# EAGLE design TLC5951_TestBrd (EAGLE 6.1)
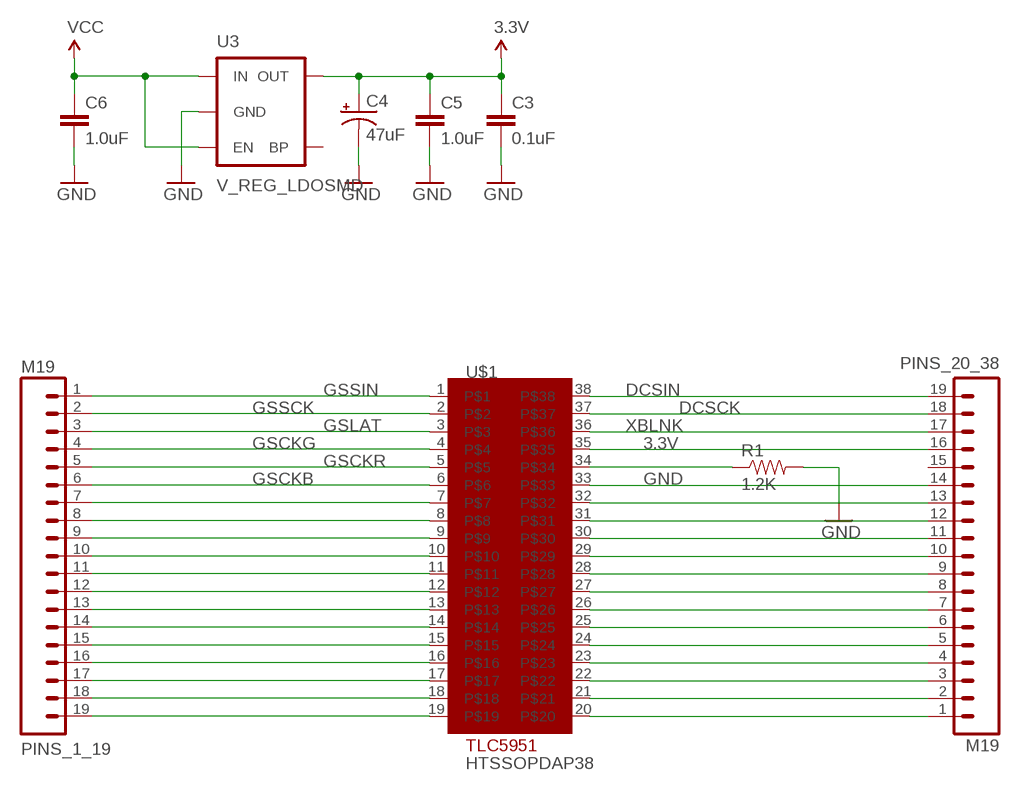
[diagram p0: schematic, sheet 1]

## Parts
C3  0.1uF  CAP0402-CAP  [0402-CAP]
C4  47uF  CAP_POL3528  [EIA3528]
C5  1.0uF  CAP0402-CAP  [0402-CAP]
C6  1.0uF  CAP0402-CAP  [0402-CAP]
PINS_1_19  M19  [1X19]
PINS_20_38  M19  [1X19]
R1  1.2K  RESISTORPTH-1W  [AXIAL-0.6]
U3  V_REG_LDOSMD  [SOT23-5]
U$1  HTSSOPDAP38  [HTSSOPDAP38]

## Nets
3.3V: C3.1 C4.A(+) C5.1 PINS_20_38.16 U3.5(OUT) U$1.35
DCSCK: PINS_20_38.18 U$1.37
DCSIN: PINS_20_38.19 U$1.38
GND: C3.2 C4.C(-) C5.2 C6.2 PINS_20_38.14 R1.P$2 U3.2(GND) U$1.33
GSCKB: PINS_1_19.6 U$1.6
GSCKG: PINS_1_19.4 U$1.4
GSCKR: PINS_1_19.5 U$1.5
GSLAT: PINS_1_19.3 U$1.3
GSSCK: PINS_1_19.2 U$1.2
GSSIN: PINS_1_19.1 U$1.1
N$1: PINS_20_38.13 U$1.32
N$2: R1.P$1 U$1.34
N$3: PINS_20_38.12 U$1.31
N$4: PINS_20_38.11 U$1.30
N$5: PINS_20_38.10 U$1.29
N$6: PINS_20_38.9 U$1.28
N$7: PINS_20_38.8 U$1.27
N$8: PINS_20_38.7 U$1.26
N$9: PINS_20_38.6 U$1.25
N$10: PINS_20_38.5 U$1.24
N$11: PINS_20_38.4 U$1.23
N$12: PINS_20_38.3 U$1.22
N$13: PINS_20_38.2 U$1.21
N$14: PINS_20_38.1 U$1.20
N$15: PINS_1_19.7 U$1.7
N$16: PINS_1_19.8 U$1.8
N$17: PINS_1_19.9 U$1.9
N$18: PINS_1_19.10 U$1.10
N$19: PINS_1_19.11 U$1.11
N$20: PINS_1_19.12 U$1.12
N$21: PINS_1_19.13 U$1.13
N$22: PINS_1_19.14 U$1.14
N$23: PINS_1_19.15 U$1.15
N$24: PINS_1_19.16 U$1.16
N$25: PINS_1_19.17 U$1.17
N$26: PINS_1_19.18 U$1.18
N$27: PINS_1_19.19 U$1.19
VCC [VCC]: C6.1 U3.1(IN) U3.3(EN)
XBLNK: PINS_20_38.17 U$1.36
Unconnected: PINS_20_38.15 U3.4(BP)

## Library data of the parts
C3 C5 C6 = SparkFun:CAP: Capacitor Standard 0603 ceramic capacitor, and 0.1" leaded capacitor.
C4 = SparkFun:CAP_POL: Capacitor Polarized These are standard SMD and PTH capacitors. Normally 10uF, 47uF, and 100uF in electrolytic and tantalum varieties. Always verify the external diameter of the through hole cap, it varies with capacity, voltage, and manufacturer. The EIA devices should be standard.
PINS_1_19 PINS_20_38 = SparkFun-Connectors:M19: 1x19 .1" header
R1 = SparkFun-Passives:RESISTOR: Resistor Basic schematic elements and footprints for 0603, 1206, and PTH resistors.
U3 = SparkFun:V_REG_LDO: Voltage Regulator LDO Standard 150mA LDO voltage regulator in SOT-23 layout. Micrel part MIC5205. BP (by-pass) pin is used to lower output noise with 470pF cap.
U$1 = TLC5951_DAP38:HTSSOPDAP38

## Net classes
0 Default: width 0.203 mm
1 VCC: width 0.305 mm

## Board
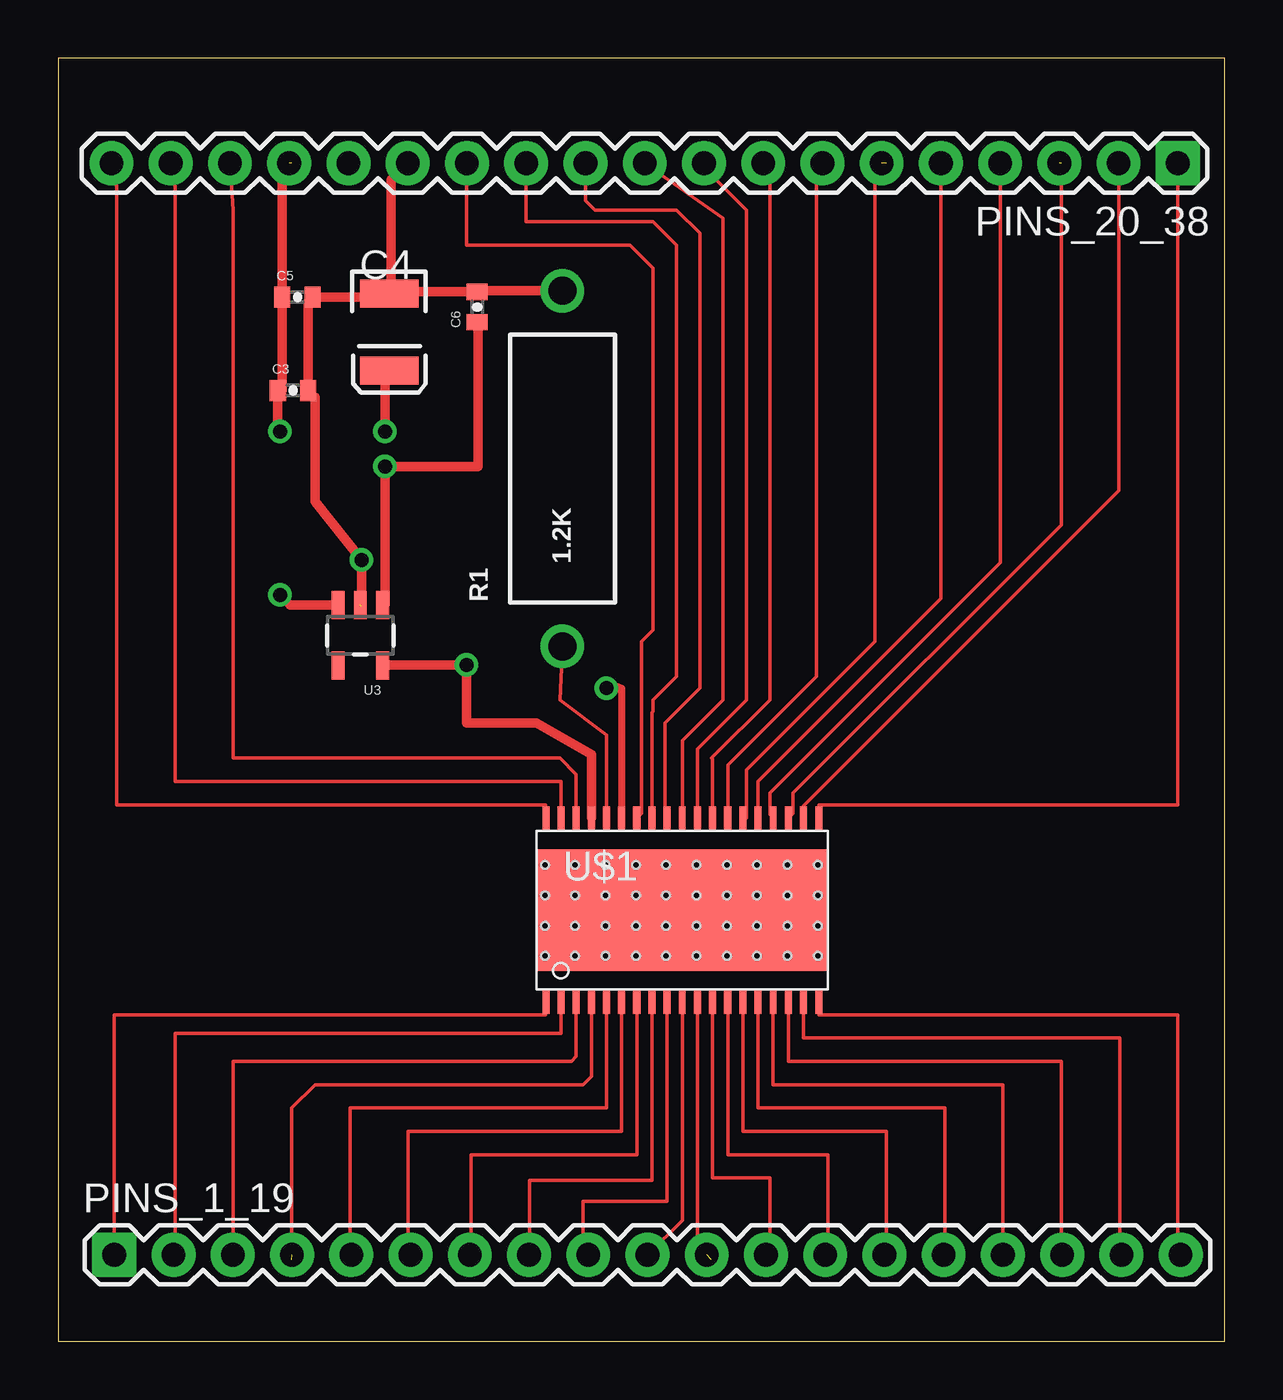
[diagram p1: board, top side]
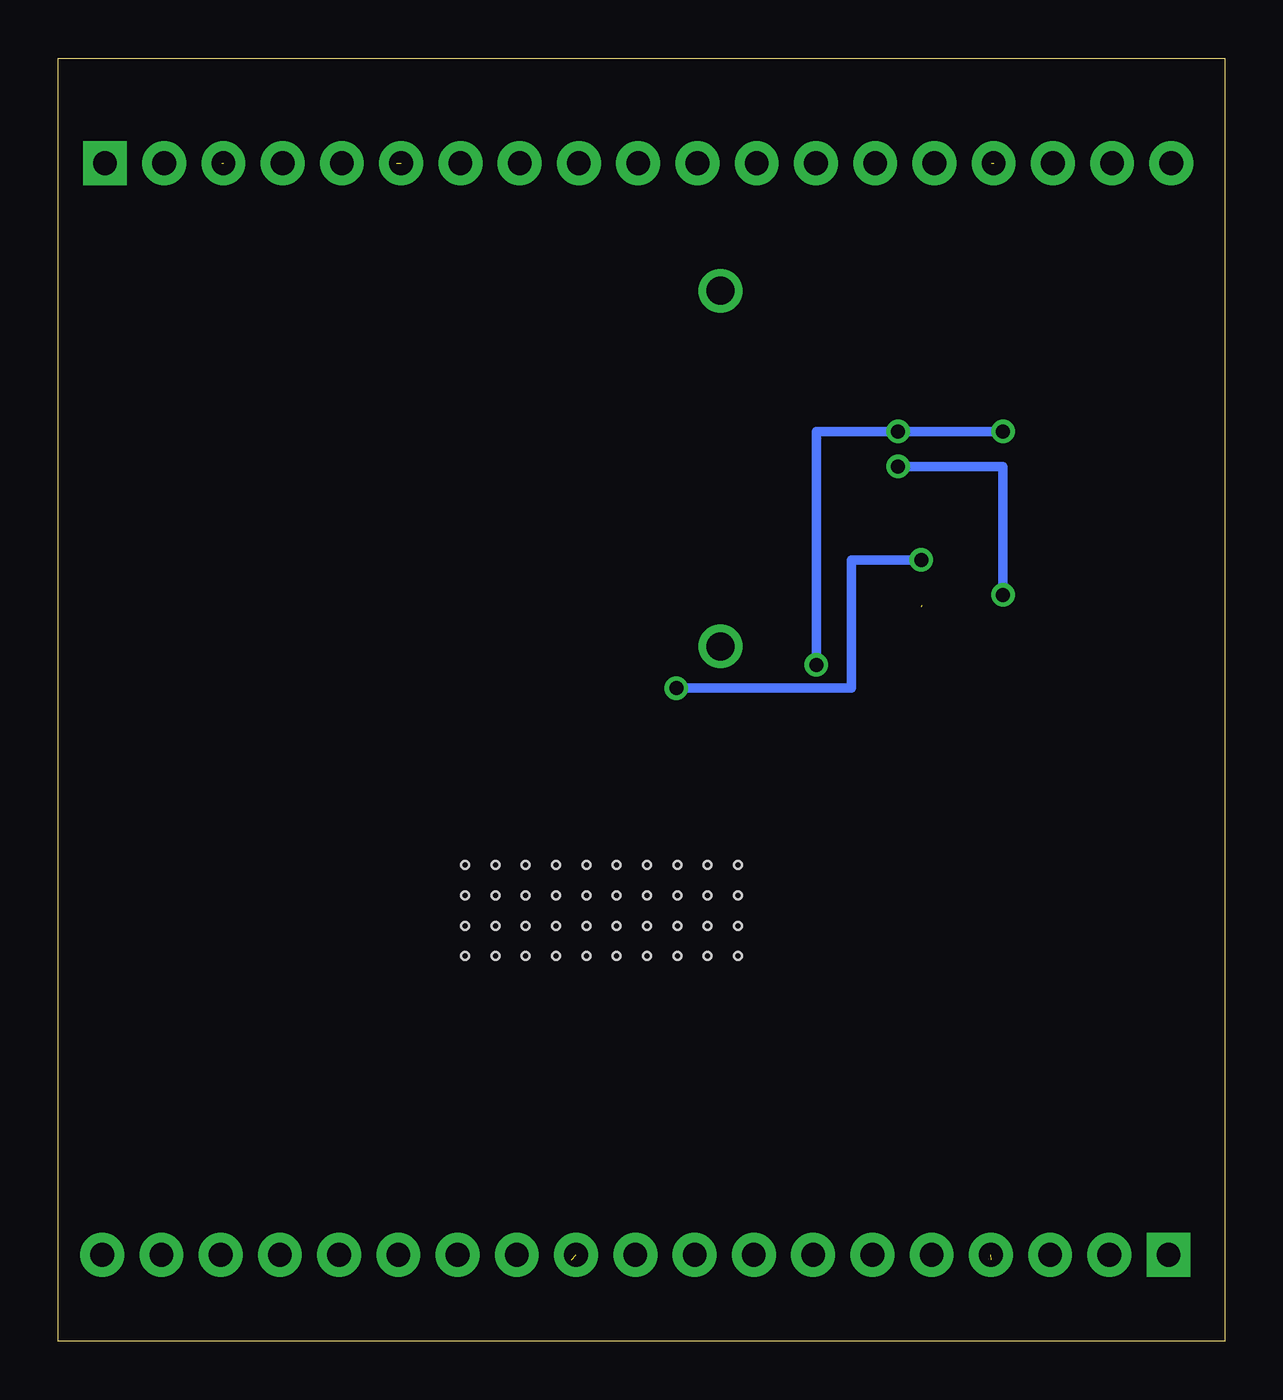
[diagram p2: board, bottom side, seen from below]

Size 50 x 55 mm. Coordinates in mm from the lower left corner, seen from the top.
Outline: 0,0 50,0 50,55 0,55 0,0
Copper layers (1*16): Top 0.035mm / dielectric 1.5mm / Bottom 0.035mm
Design rules: minimum track width 10mil, minimum drill 24mil, track to track 8mil, track to pad 8mil, pad to pad 8mil, via to via 8mil, smd to smd 8mil, copper to edge 40mil, drill to drill 8mil, minimum pad ring 10mil, minimum via ring 8mil, stop-mask expansion 4mil, vias tented up to drill 0mil, thermal gap 10mil

### Footprints (pad centres in the part's own frame; a part is rotated, then mirrored left to right if it is on the bottom)
0402-CAP = smd 0.7 x 0.9: 1 -0.65,0; 2 0.65,0
EIA3528 = smd 1.2 x 2.5: A 1.65,0; C -1.65,0
1X19 = drill 1.016 pad 1.88 square: 1 0,0 | drill 1.016 pad 1.88: 2 2.54,0; 3 5.08,0; 4 7.62,0; 5 10.16,0; 6 12.7,0; 7 15.24,0; 8 17.78,0; 9 20.32,0; 10 22.86,0; 11 25.4,0; 12 27.94,0; 13 30.48,0; 14 33.02,0; 15 35.56,0; 16 38.1,0; 17 40.64,0; 18 43.18,0; 19 45.72,0
AXIAL-0.6 = drill 1.2 pad 1.88: P$1 -7.62,0; P$2 7.62,0
SOT23-5 = smd 0.55 x 1.2: 1 -0.95,-1.3; 2 0,-1.3; 3 0.95,-1.3; 4 0.95,1.3; 5 -0.95,1.3
HTSSOPDAP38 = smd 0.3 x 1: 1 3.04,3.67; 2 3.69,3.67; 3 4.34,3.67; 4 4.99,3.67; 5 5.64,3.67; 6 6.29,3.67; 7 6.94,3.67; 8 7.59,3.67; 9 8.24,3.67; 10 8.89,3.67; 11 9.54,3.67; 12 10.19,3.67; 13 10.84,3.67; 14 11.49,3.67; 15 12.14,3.67; 16 12.79,3.67; 17 13.44,3.67; 18 14.09,3.67; 19 14.74,3.67; 20 14.74,11.57; 21 14.09,11.57; 22 13.44,11.57; 23 12.79,11.57; 24 12.14,11.57; 25 11.49,11.57; 26 10.84,11.57; 27 10.19,11.57; 28 9.54,11.57; 29 8.89,11.57; 30 8.24,11.57; 31 7.59,11.57; 32 6.94,11.57; 33 6.29,11.57; 34 5.64,11.57; 35 4.99,11.57; 36 4.34,11.57; 37 3.69,11.57; 38 3.04,11.57 | smd 12.5 x 5.2: EXP 8.89,7.62 | hole 0.33: 3,5.65; 4.3,5.65; 3,6.95; 4.3,6.95; 3,8.25; 4.3,8.25; 3,9.55; 4.3,9.55; 5.6,5.65; 6.9,5.65; 5.6,6.95; 6.9,6.95; 5.6,8.25; 6.9,8.25; 5.6,9.55; 6.9,9.55; 8.2,5.65; 9.5,5.65; 8.2,6.95; 9.5,6.95; 8.2,8.25; 9.5,8.25; 8.2,9.55; 9.5,9.55; 10.8,5.65; 12.1,5.65; 10.8,6.95; 12.1,6.95; 10.8,8.25; 12.1,8.25; 10.8,9.55; 12.1,9.55; 13.4,5.65; 14.7,5.65; 13.4,6.95; 14.7,6.95; 13.4,8.25; 14.7,8.25; 13.4,9.55; 14.7,9.55

### Placement (x,y rotation side)
C3  10.06,40.76 0 top
C4  14.19,43.26 270 top
C5  10.25,44.76 0 top
C6  17.96,44.34 90 top
PINS_1_19  2.4,3.7 0 top
PINS_20_38  48,50.5 180 top
R1  21.61,37.41 90 top
U3  12.95,30.26 180 top
U$1  17.86,10.86 0 top

### Tracks (layer width: path | path; a pad name or v marks a point on that pad's centre or on a via)
3.3V  (via drill 0.6)  (1 unrouted)
  Top 0.152: 13.9,29 U3.5
  Top 0.406: C4.A 14,41.61 v14,39 | v9.5,39 9.41,39 C3.1 9.6,40.76 C5.1 9.6,50.1 10,50.5 | 13.9,29 v17.5,29 17.5,26.5 20.5,26.5 22.85,25.15 U$1.35
  Bottom 0.406: v9.5,39 v14,39 17.5,39 v17.5,29
DCSCK
  Top 0.152: U$1.37 21.55,24 5,24 5,49.5 PINS_20_38.18
DCSIN
  Top 0.152: U$1.38 20.9,23 2.5,23 2.5,49.5 PINS_20_38.19
GND  (via drill 0.6)  (1 unrouted)
  Top 0.152: C3.2 11,40.47
  Top 0.305: 24,28 24.15,28 U$1.33
  Top 0.406: 11,40.47 11,36 v13,33.5 13,31.5 | 14.27,44.99 C4.C 14.04,44.76 C5.2 10.71,44.57 C3.2 | 14.27,44.99 C6.2 18,45.03 R1.P$2 | 24,28 v23.5,28 | 14.27,44.99 14.27,49.79 PINS_20_38.14
  Bottom 0.406: v23.5,28 16,28 16,33.5 v13,33.5
GSCKB
  Top 0.152: U$1.6 24.15,9 15,9 15,3.7 PINS_1_19.6
GSCKG  (1 unrouted)
  Top 0.152: U$1.4 22.85,11.35 22.5,11 11,11 10,10 10,3.5
GSCKR
  Top 0.152: U$1.5 23.5,10 12.5,10 12.5,3.76 PINS_1_19.5
GSLAT
  Top 0.152: U$1.3 22.2,12.2 22,12 7.5,12 7.5,3.72 PINS_1_19.3
GSSCK
  Top 0.152: U$1.2 21.55,13.2 5,13.2 5,3.76 PINS_1_19.2
GSSIN
  Top 0.152: U$1.1 20.9,14 2.4,14 PINS_1_19.1
N$1
  Top 0.152: 17.5,50.5 17.5,47 24.5,47 25.5,46 25.5,30.5 25,30 25,22.63 U$1.32
  Top 0.254: PINS_20_38.13 17.5,50.5
N$2
  Top 0.152: U$1.34 23.5,26 21.5,27.5 R1.P$1
N$3
  Top 0.152: U$1.31 25.45,26.95 25.5,27 25.5,27.5 26.5,28.5 26.5,47 25.5,48 20.06,48 PINS_20_38.12
N$4
  Top 0.152: PINS_20_38.11 22.6,48.9 23,48.5 26.5,48.5 27.5,47.5 27.5,28 26,26.5 26,22.53 U$1.30
N$5
  Top 0.152: U$1.29 26.75,25.75 28.5,27.5 28.5,48.14 PINS_20_38.10
N$6
  Top 0.152: U$1.28 27.4,25.4 29.5,27.5 29.5,48.5 27.68,50.32 PINS_20_38.9
N$7
  Top 0.152: U$1.27 28.05,24.95 28,25 30.5,27.5 30.5,49.72 PINS_20_38.8
N$8
  Top 0.152: U$1.26 28.7,24.7 32.5,28.5 32.5,50.5 PINS_20_38.7
N$9  (1 unrouted)
  Top 0.152: U$1.25 29.5,22.43 29.5,24.5 35,30 35,50.5 35.5,50.5
N$10
  Top 0.152: PINS_20_38.5 37.84,31.84 30,24 U$1.24
N$11
  Top 0.152: PINS_20_38.4 40.38,33.38 30.5,23.5 30.5,22.58 U$1.23
N$12  (1 unrouted)
  Top 0.152: 43,50.5 43,35 31.5,23.5 31.5,22.63 U$1.22
N$13
  Top 0.152: PINS_20_38.2 45.46,36.46 31.95,22.95 U$1.21
N$14
  Top 0.152: U$1.20 32.6,23 48,23 PINS_20_38.1
N$15
  Top 0.152: U$1.7 24.8,8 17.7,8 17.7,3.76 PINS_1_19.7
N$16
  Top 0.152: U$1.8 25.45,6.9 20.2,6.9 20.2,3.72 PINS_1_19.8
N$17
  Top 0.152: U$1.9 26.1,6 22.5,6 22.5,3.92 PINS_1_19.9
N$18
  Top 0.152: U$1.10 26.75,5.19 PINS_1_19.10
N$19  (1 unrouted)
  Top 0.152: U$1.11 27.4,4.1 28,3.5
N$20
  Top 0.152: U$1.12 28.05,7 30.5,7 30.5,3.86 PINS_1_19.12
N$21
  Top 0.152: U$1.13 28.7,8 33,8 33,3.82 PINS_1_19.13
N$22
  Top 0.152: U$1.14 29.35,9 35.5,9 35.5,3.7 PINS_1_19.14
N$23
  Top 0.152: U$1.15 30,10 38,10 38,3.74 PINS_1_19.15
N$24
  Top 0.152: U$1.16 30.65,11 40.5,11 PINS_1_19.16
N$25
  Top 0.152: U$1.17 31.3,12 43,12 43,3.7 PINS_1_19.17
N$26
  Top 0.152: U$1.18 31.95,13 45.5,13 45.5,3.7 PINS_1_19.18
N$27
  Top 0.152: U$1.19 32.6,14 48,14 48,3.7 PINS_1_19.19
N$29  (via drill 0.6)
  other vias: 14,39
N$30  (via drill 0.6)
  other vias: 14,37.5
N$31  (via drill 0.6)
  other vias: 9.5,39
VCC  (via drill 0.6)
  Top 0.152: C6.1 18,43.65 | U3.1 14,31.56
  Top 0.406: 18,43.65 18,37.5 v14,37.5 14,31.56 | v9.5,32 9.94,31.56 U3.3
  Bottom 0.406: v14,37.5 9.5,37.5 v9.5,32
XBLNK
  Top 0.152: PINS_20_38.17 7.5,48.5 7.5,25 21.5,25 22.2,24.3 U$1.36